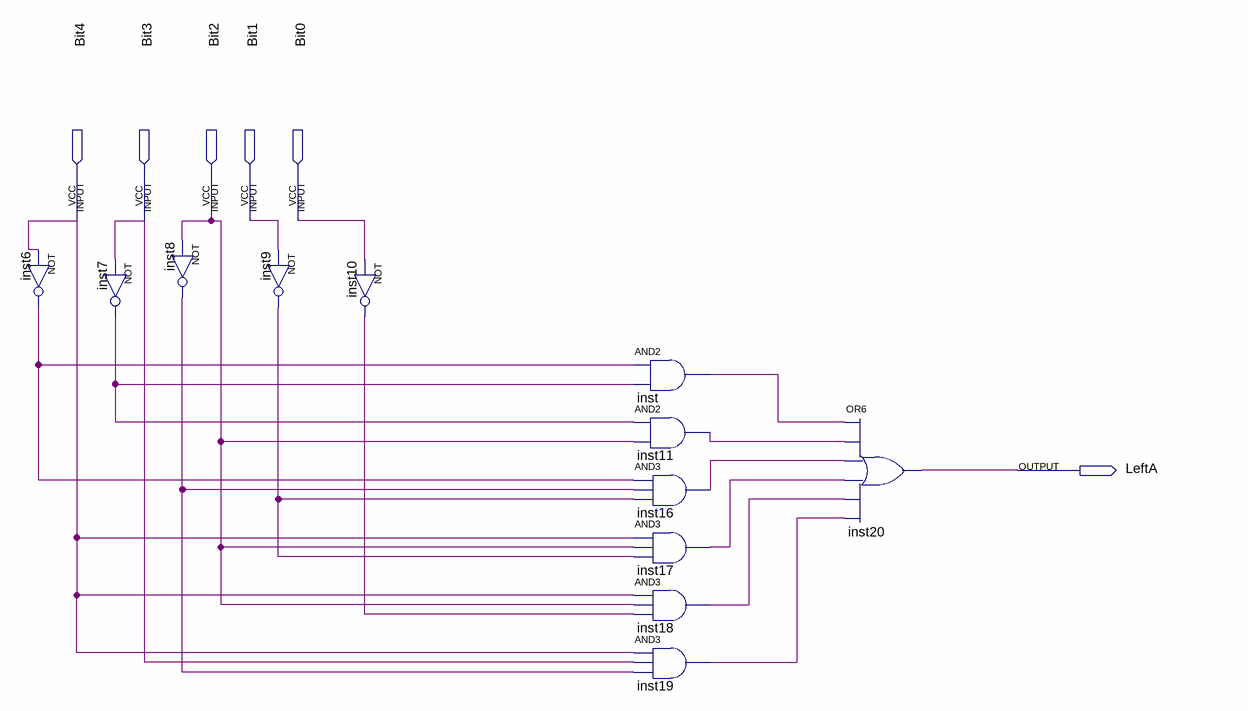
[diagram p0: schematic sheet]
// Quartus schematic LeftA.bdf as structural Verilog: 12 symbols, 6 pins
module LeftA (
  input  Bit4,
  input  Bit3,
  input  Bit2,
  input  Bit1,
  input  Bit0,
  output LeftA
);

  wire inst6_out, inst7_out, inst8_out, inst9_out, inst10_out, inst11_out, inst16_out, inst17_out,
       inst18_out, inst19_out, inst_out;

  not inst6 (inst6_out, Bit4);
  not inst7 (inst7_out, Bit3);
  not inst8 (inst8_out, Bit2);
  not inst9 (inst9_out, Bit1);
  not inst10 (inst10_out, Bit0);
  and inst (inst_out, inst6_out, inst7_out);
  and inst11 (inst11_out, inst7_out, Bit2);
  and inst16 (inst16_out, inst6_out, inst8_out, inst9_out);
  and inst17 (inst17_out, Bit4, Bit2, inst9_out);
  and inst18 (inst18_out, Bit4, Bit2, inst10_out);
  and inst19 (inst19_out, Bit4, Bit3, inst8_out);
  or inst20 (LeftA, inst_out, inst11_out, inst16_out, inst17_out, inst18_out, inst19_out);
endmodule
